# EAGLE design Rocketometer2148 (EAGLE 6.2)
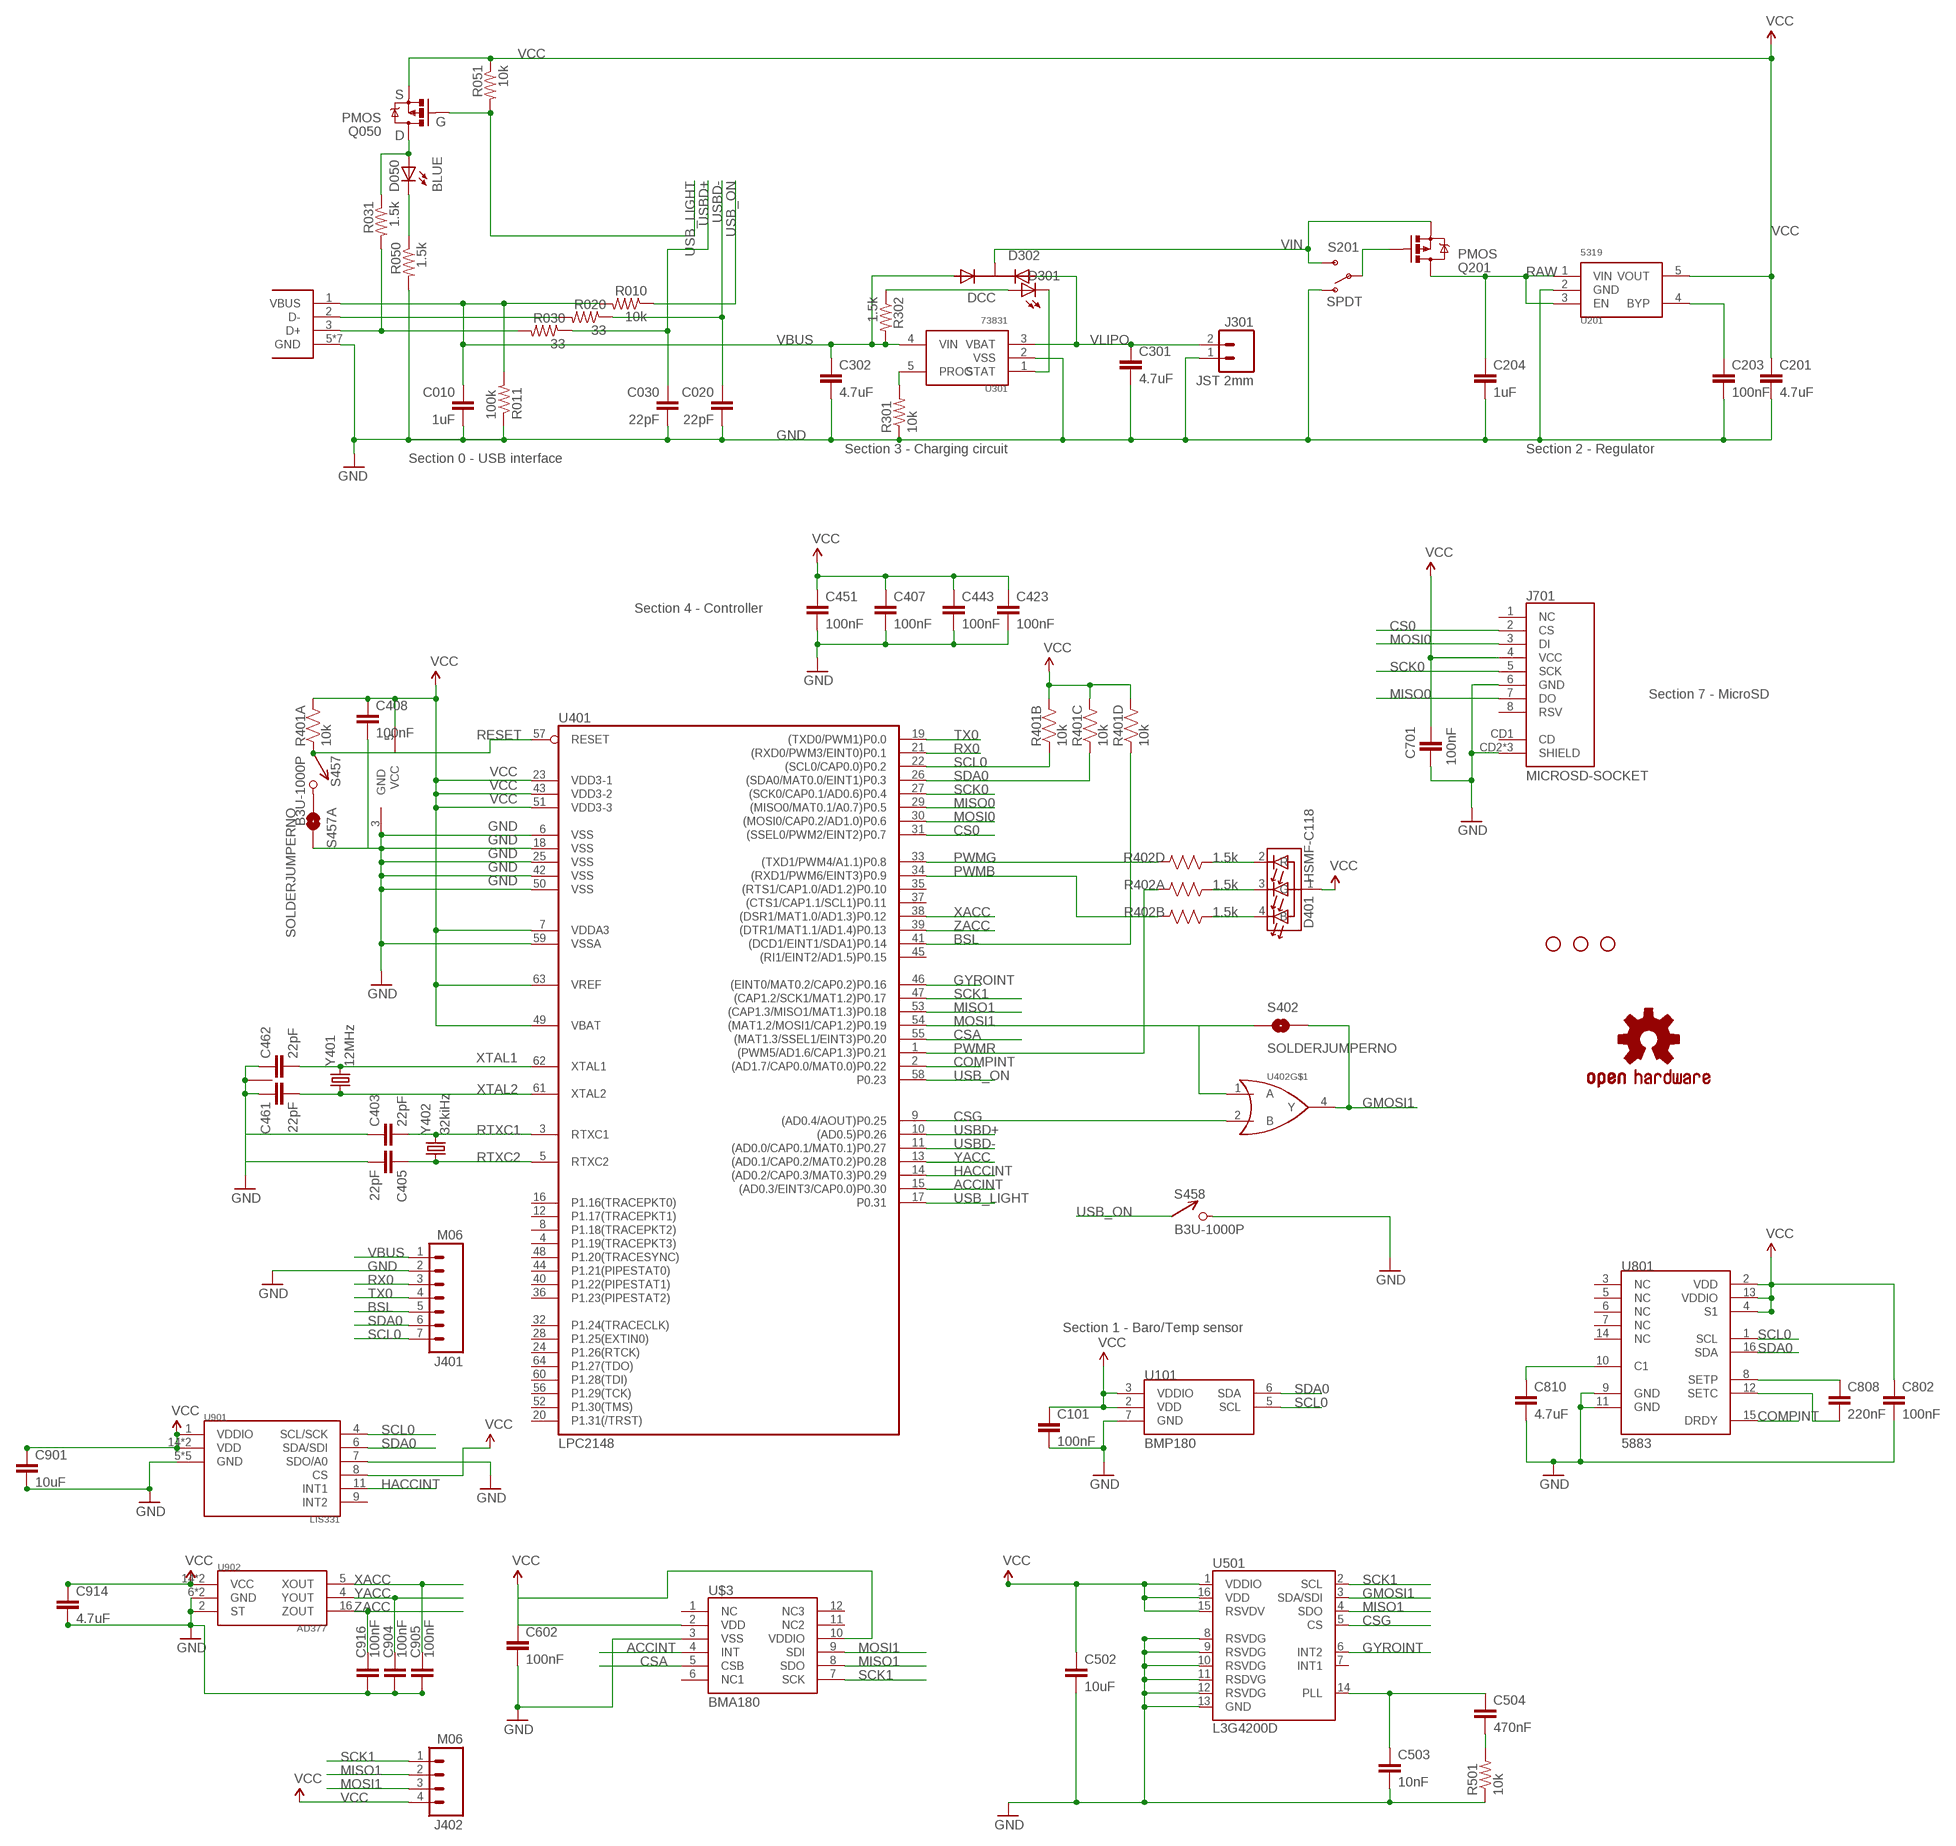
[diagram p0: schematic, sheet 1]

## Parts
C010  1uF  CAP0402-CAP  [0402-CAP]
C020  22pF  CAP0402-CAP  [0402-CAP]
C030  22pF  CAP0402-CAP  [0402-CAP]
C101  100nF  CAP0402-CAP  [0402-CAP]
C201  4.7uF  CAP0402-CAP  [0402-CAP]
C203  100nF  CAP0402-CAP  [0402-CAP]
C204  1uF  CAP0402-CAP  [0402-CAP]
C301  4.7uF  CAP0402-CAP  [0402-CAP]
C302  4.7uF  CAP0402-CAP  [0402-CAP]
C403  22pF  CAP0402-CAP  [0402-CAP]
C405  22pF  CAP0402-CAP  [0402-CAP]
C407  100nF  CAP0402-CAP  [0402-CAP]
C408  100nF  CAP0402-CAP  [0402-CAP]
C423  100nF  CAP0402-CAP  [0402-CAP]
C443  100nF  CAP0402-CAP  [0402-CAP]
C451  100nF  CAP0402-CAP  [0402-CAP]
C461  22pF  CAP0402-CAP  [0402-CAP]
C462  22pF  CAP0402-CAP  [0402-CAP]
C502  10uF  CAP0603-CAP  [0603-CAP]
C503  10nF  CAP0402-CAP  [0402-CAP]
C504  470nF  CAP0402-CAP  [0402-CAP]
C602  100nF  CAP0402-CAP  [0402-CAP]
C701  100nF  CAP0402-CAP  [0402-CAP]
C802  100nF  CAP0402-CAP  [0402-CAP]
C808  220nF  CAP0402-CAP  [0402-CAP]
C810  4.7uF  CAP0402-CAP  [0402-CAP]
C901  10uF  CAP0603-CAP  [0603-CAP]
C904  100nF  CAP0402-CAP  [0402-CAP]
C905  100nF  CAP0402-CAP  [0402-CAP]
C914  4.7uF  CAP0402-CAP  [0402-CAP]
C916  100nF  CAP0402-CAP  [0402-CAP]
D050  BLUE  LED0603  [LED-0603]
D301  YELLOW  LED0603  [LED-0603]
D302  DCC  PMEG2005CT  [SOT-23-3]
D401  HSMF-C118  [HSMF-C118]
J001  USB_MICROB_JST  [UB-MC5BR3-SD204-4S]
J301  JST 2mm  M02-JST-2MM-SMT  [JST-2-SMD]
J401  M06  M07  [1X07]
J402  M06  M04PTH  [1X04]
J701  MICROSD-SOCKET  [MICROSD-SOCKET-PP]
JP1  STAND-OFFTIGHT  [STAND-OFF-TIGHT]
JP2  STAND-OFFTIGHT  [STAND-OFF-TIGHT]
JP3  STAND-OFFTIGHT  [STAND-OFF-TIGHT]
Q050  PMOS  MOSFET-PCHANNELSMD  [SOT23-3]
Q201  PMOS  MOSFET-PCHANNELSMD  [SOT23-3]
R010  10k  RESISTOR0402-RES  [0402-RES]
R011  100k  RESISTOR0402-RES  [0402-RES]
R020  33  RESISTOR0402-RES  [0402-RES]
R030  33  RESISTOR0402-RES  [0402-RES]
R031  1.5k  RESISTOR0402-RES  [0402-RES]
R050  1.5k  RESISTOR0402-RES  [0402-RES]
R051  10k  RESISTOR0402-RES  [0402-RES]
R301  10k  RESISTOR0402-RES  [0402-RES]
R302  1.5k  RESISTOR0402-RES  [0402-RES]
R401  10k  RP404  [CRA04]
R402  1.5k  RP404  [CRA04]
R501  10k  RESISTOR0402-RES  [0402-RES]
S201  SPDT  SWITCH-SPSTSMD  [AYZ0202]
S402  SOLDERJUMPERNO  [SJ_2S-NO]
S457  B3U-1000P  [B3U-1000P]
S457A  SOLDERJUMPERNO  [SJ_2S-NO]
S458  B3U-1000P  [B3U-1000P]
U101  BMP180  [BMP180]
U201  5319  MIC5319D5  [SOT-23-5]
U301  73831  MCP73831  [SOT-23-5]
U401  LPC2148  LPC213X  [SQFP-S-10X10-64]
U402  SN74LVC1G32  [SOT-23-5]
U501  L3G4200D  [LGA16-4X4]
U801  5883  HMC5883LSMD  [16LPCC]
U901  LIS331  H3LIS331DL  [LLGA16]
U902  AD377  ADXL377  [ADXL377]
U$2  OSHW-LOGOS  [OSHW-LOGO-S]
U$3  BMA180  [LGA12]
Y401  12MHz  CX2520  [CRYSTAL_SMD_2MM_2_5MM]
Y402  32kiHz  ABS06  [ABS06]

## Nets
ACCINT: U401.15((AD0.3/EINT3/CAP0.0)P0.30) U$3.4(INT)
BSL: J401.5 R401.4 U401.41((DCD1/EINT1/SDA1)P0.14)
COMPINT: U401.2((AD1.7/CAP0.0/MAT0.0)P0.22) U801.15(DRDY)
CONN_D+: J001.3(D+) R030.2 R031.2
CONN_D-: J001.2(D-) R020.2
CS0: J701.2(CS) U401.31((SSEL0/PWM2/EINT2)P0.7)
CSA: U401.55((MAT1.3/SSEL1/EINT3)P0.20) U$3.5(CSB)
CSG: U401.9((AD0.4/AOUT)P0.25) U402.2(B) U501.5(CS)
GMOSI1: S402.2 U402.4(Y) U501.3(SDA/SDI)
GND [power]: C010.2 C020.2 C030.2 C101.2 C201.2 C203.2 C204.2 C301.2 C302.2 C403.1 C405.2 C407.2 C408.2 C423.2 C443.2 C451.2 C461.1 C462.1 C502.2 C503.2 C602.2 C701.2 C802.2 C810.2 C901.2 C904.2 C905.2 C914.2 C916.2 J001.5(GND) J001.P$6(GND) J001.P$7(GND) J001.P$8(GND) J001.P$9(GND) J001.P$10(GND) J001.P$11(GND) J301.1 J401.2 J701.6(GND) J701.CD2(SHIELD) J701.GND1(SHIELD) J701.GND3(SHIELD) R011.1 R050.2 R301.1 R501.1 S201.1(O) S457A.2 S458.P$2 U101.7(GND) U201.2(GND) U301.2(VSS) U401.6(VSS) U401.18(VSS) U401.25(VSS) U401.42(VSS) U401.50(VSS) U401.59(VSSA) U402.3(GND) U501.8(RSVDG) U501.9(RSVDG) U501.10(RSVDG) U501.11(RSDVG) U501.12(RSVDG) U501.13(GND) U801.9(GND) U801.11(GND) U901.5(GND) U901.7(SDO/A0) U901.10(GND) U901.12(GND) U901.13(GND) U901.16(GND) U902.2(ST) U902.6(GND) U902.7(GND) U$3.3(VSS) Y401.2 Y401.4
GYROINT: U401.46((EINT0/MAT0.2/CAP0.2)P0.16) U501.6(INT2)
HACCINT: U401.14((AD0.2/CAP0.3/MAT0.3)P0.29) U901.11(INT1)
MISO0: J701.7(DO) U401.29((MISO0/MAT0.1/A0.7)P0.5)
MISO1: J402.2 U401.53((CAP1.3/MISO1/MAT1.3)P0.18) U501.4(SDO) U$3.8(SDO)
MOSI0: J701.3(DI) U401.30((MOSI0/CAP0.2/AD1.0)P0.6)
MOSI1: J402.3 S402.1 U401.54((MAT1.2/MOSI1/CAP1.2)P0.19) U402.1(A) U$3.9(SDI)
N$1: C504.2 R501.2
N$2: R301.2 U301.5(PROG)
N$3: D401.4(B) R402.2
N$4: D301.C U301.1(STAT)
N$5: D301.A R302.1
N$6: D050.A Q050.3(D) R031.1
N$7: D050.C R050.1
N$8: S457.P$2 S457A.1
N$9: D401.2(R) R402.4
N$10: Q201.1(G) S201.2(P)
N$11: D401.3(G) R402.1
N$14: C808.1 U801.8(SETP)
N$15: C808.2 U801.12(SETC)
N$16: C810.1 U801.10(C1)
N$17: C203.1 U201.4(BYP)
N$20: C503.1 C504.1 U501.14(PLL)
PWMB: R402.7 U401.34((RXD1/PWM6/EINT3)P0.9)
PWMG: R402.5 U401.33((TXD1/PWM4/A1.1)P0.8)
PWMR: R402.8 U401.1((PWM5/AD1.6/CAP1.3)P0.21)
RAW: C204.1 Q201.3(D) U201.1(VIN) U201.3(EN)
RESET [power]: R401.1 S457.P$1 U401.57(RESET)
RTXC1: C403.2 U401.3(RTXC1) Y402.2
RTXC2: C405.1 U401.5(RTXC2) Y402.1
RX0: J401.3 U401.21((RXD0/PWM3/EINT0)P0.1)
SCK0: J701.5(SCK) U401.27((SCK0/CAP0.1/AD0.6)P0.4)
SCK1: J402.1 U401.47((CAP1.2/SCK1/MAT1.2)P0.17) U501.2(SCL) U$3.7(SCK)
SCL0: J401.7 R401.2 U101.5(SCL) U401.22((SCL0/CAP0.0)P0.2) U801.1(SCL) U901.4(SCL/SCK)
SDA0: J401.6 R401.3 U101.6(SDA) U401.26((SDA0/MAT0.0/EINT1)P0.3) U801.16(SDA) U901.6(SDA/SDI)
TX0: J401.4 U401.19((TXD0/PWM1)P0.0)
USB_LIGHT: Q050.1(G) R051.2 U401.17(P0.31)
USB_ON: R010.1 S458.P$1 U401.58(P0.23)
USBD+: C030.1 R030.1 U401.10((AD0.5)P0.26)
USBD-: C020.1 R020.1 U401.11((AD0.0/CAP0.1/MAT0.1)P0.27)
VBUS: C010.1 C302.1 D302.1(A1) J001.1(VBUS) J401.1 R010.2 R011.2 R302.2 U301.4(VIN)
VCC [power]: C101.1 C201.1 C407.1 C408.1 C423.1 C443.1 C451.1 C502.1 C602.1 C701.1 C802.1 C901.1 C914.1 D401.1(A) J402.4 J701.4(VCC) Q050.2(S) R051.1 R401.5 R401.6 R401.7 R401.8 U101.2(VDD) U101.3(VDDIO) U201.5(VOUT) U401.7(VDDA3) U401.23(VDD3-1) U401.43(VDD3-2) U401.49(VBAT) U401.51(VDD3-3) U401.63(VREF) U402.5(VCC) U501.1(VDDIO) U501.15(RSVDV) U501.16(VDD) U801.2(VDD) U801.4(S1) U801.13(VDDIO) U901.1(VDDIO) U901.8(CS) U901.14(VDD) U901.15(VDD) U902.14(VCC) U902.15(VCC) U$3.2(VDD) U$3.10(VDDIO)
VIN: D302.3(K) Q201.2(S) S201.3(S)
VLIPO: C301.1 D302.2(A2) J301.2 U301.3(VBAT)
XACC: C905.1 U401.38((DSR1/MAT1.0/AD1.3)P0.12) U902.5(XOUT)
XTAL1: C462.2 U401.62(XTAL1) Y401.3
XTAL2: C461.2 U401.61(XTAL2) Y401.1
YACC: C904.1 U401.13((AD0.1/CAP0.2/MAT0.2)P0.28) U902.4(YOUT)
ZACC: C916.1 U401.39((DTR1/MAT1.1/AD1.4)P0.13) U902.16(ZOUT)
Unconnected: J701.1(NC) J701.8(RSV) J701.CD1(CD) R402.3 R402.6 U401.4(P1.19(TRACEPKT3)) U401.8(P1.18(TRACEPKT2)) U401.12(P1.17(TRACEPKT1)) U401.16(P1.16(TRACEPKT0)) U401.20(P1.31(/TRST)) U401.24(P1.26(RTCK)) U401.28(P1.25(EXTIN0)) U401.32(P1.24(TRACECLK)) U401.35((RTS1/CAP1.0/AD1.2)P0.10) U401.36(P1.23(PIPESTAT2)) U401.37((CTS1/CAP1.1/SCL1)P0.11) U401.40(P1.22(PIPESTAT1)) U401.44(P1.21(PIPESTAT0)) U401.45((RI1/EINT2/AD1.5)P0.15) U401.48(P1.20(TRACESYNC)) U401.52(P1.30(TMS)) U401.56(P1.29(TCK)) U401.60(P1.28(TDI)) U401.64(P1.27(TDO)) U501.7(INT1) U801.3(NC) U801.5(NC) U801.6(NC) U801.7(NC) U801.14(NC) U901.9(INT2) U$3.1(NC) U$3.6(NC1) U$3.11(NC2) U$3.12(NC3)

## Notes on the sheet
- S
- G
- D
- Section 0 - USB interface | Section 3 - Charging circuit | Section 2 - Regulator
- Section 4 - Controller
- Section 7 - MicroSD
- Section 1 - Baro/Temp sensor

## Library data of the parts
C010 C204 = SparkFun:CAP: Capacitor Standard 0603 ceramic capacitor, and 0.1" leaded capacitor.; DIGIKEY: 445-1415-1-ND
C020 C030 C403 C405 C461 C462 = SparkFun:CAP: Capacitor Standard 0603 ceramic capacitor, and 0.1" leaded capacitor.; DIGIKEY: 445-1239-1-ND
C101 C203 C407 C408 C423 C443 C451 C701 C802 C904 C905 C916 = SparkFun:CAP: Capacitor Standard 0603 ceramic capacitor, and 0.1" leaded capacitor.; DIGIKEY: 445-1268-1-ND
C201 C301 C302 C602 C810 C914 = SparkFun:CAP: Capacitor Standard 0603 ceramic capacitor, and 0.1" leaded capacitor.; DIGIKEY: 445-7395-1-ND
C502 C901 = SparkFun:CAP: Capacitor Standard 0603 ceramic capacitor, and 0.1" leaded capacitor.; DIGIKEY: 445-7486-1-ND
C503 = SparkFun:CAP: Capacitor Standard 0603 ceramic capacitor, and 0.1" leaded capacitor.; DIGIKEY: 445-4943-1-ND
C504 = SparkFun:CAP: Capacitor Standard 0603 ceramic capacitor, and 0.1" leaded capacitor.; DIGIKEY: 445-4976-1-ND
C808 = SparkFun:CAP: Capacitor Standard 0603 ceramic capacitor, and 0.1" leaded capacitor.; DIGIKEY: 445-4972-1-ND
D050 = SparkFun:LED: LEDs Standard schematic elements and footprints for 5mm, 3mm, 1206, and 0603 sized LEDs. 5mm - Spark Fun Electronics SKU : COM-00529 (and others); DIGIKEY: 754-1434-1-ND
D301 = SparkFun:LED: LEDs Standard schematic elements and footprints for 5mm, 3mm, 1206, and 0603 sized LEDs. 5mm - Spark Fun Electronics SKU : COM-00529 (and others); DIGIKEY: 754-1354-1-ND
D302 = KwanSystems:PMEG2005CT; DIGIKEY: 568-6500-1-ND
D401 = KwanSystems:HSMF-C118; DIGIKEY: 516-1778-1-ND
J001 = KwanSystems:USB_MICROB_JST; DIGIKEY: 455-2562-1-ND
J301 = SparkFun:M02: Header 2 Standard 2-pin 0.1" header. Use with straight break away headers (SKU : PRT-00116), right angle break away headers (PRT-00553), swiss pins (PRT-00743), machine pins (PRT-00117), and female headers (PRT-00115). Molex polarized connector foot print use with SKU : PRT-08233 with associated crimp pins and housings.; DIGIKEY: 455-1749-1-ND
J401 = SparkFun-Connectors:M07: Header 7 Standard 7-pin 0.1" header. Use with straight break away headers (SKU : PRT-00116), right angle break away headers (PRT-00553), swiss pins (PRT-00743), machine pins (PRT-00117), and female headers (PRT-00115). NOTES ON THE VARIANTS LOCK and LOCK_LONGPADS... This footprint was designed to help hold the alignment of a through-hole component (i.e. 7-pin header) while soldering it into place. You may notice that each hole has been shifted either up or down by 0.005 of an inch from it's more standard position (which is usually a perfectly straight line). This slight alteration caused the pins (the squares in the middle) to touch the edges of the holes. Because they are alternating, it causes a "brace" to hold the header in place. 0.005 has proven to be the perfect amount of "off-center" position when using our standard breakaway headers. Although looks a little odd when you look at the bare footprint, once you have a header in there, the alteration is very hard to notice. Also, if you push a header all the way into place, it is covered up entirely on the bottom side. This idea of altering the position of holes to aid alignment will be further integrated into the Sparkfun Library for other footprints. It can help hold any component with 3 or more connection pins.; DIGIKEY: $NOPART
J402 = SparkFun-Connectors:M04: Header 4 Standard 4-pin 0.1" header. Use with straight break away headers (SKU : PRT-00116), right angle break away headers (PRT-00553), swiss pins (PRT-00743), machine pins (PRT-00117), and female headers (PRT-00115). Molex polarized connector foot print use with SKU : PRT-08231 with associated crimp pins and housings. 1MM SMD Version SKU: PRT-10208; DIGIKEY: $NOPART
J701 = KwanSystems:MICROSD-SOCKET: microSD Socket Push-push type uSD socket. Digikey 101-00660-68-6-1-ND. tDoc lines correctly indicate media card edge positions when inserting (unlocked, locked, depressed).; DIGIKEY: 101-00581-59-1-ND
JP1-JP3 = SparkFun-Electromechanical:STAND-OFF: #4 Stand Off This is the mechanical footprint for a #4 phillips button head screw. Use the keepout ring to avoid running the screw head into surrounding components. SKU : PRT-00447; DIGIKEY: $NOPART
Q050 Q201 = SparkFun:MOSFET-PCHANNEL; DIGIKEY: NTR1P02T1GOSCT-ND
R010 R051 R301 R501 = SparkFun:RESISTOR: Resistor Basic schematic elements and footprints for 0603, 1206, and PTH resistors.; DIGIKEY: P10.0KLCT-ND
R011 = SparkFun:RESISTOR: Resistor Basic schematic elements and footprints for 0603, 1206, and PTH resistors.; DIGIKEY: P100KLCT-ND
R020 R030 = SparkFun:RESISTOR: Resistor Basic schematic elements and footprints for 0603, 1206, and PTH resistors.; DIGIKEY: P33.0LCT-ND
R031 R050 R302 = SparkFun:RESISTOR: Resistor Basic schematic elements and footprints for 0603, 1206, and PTH resistors.; DIGIKEY: P1.50KLCT-ND
R401 = KwanSystems:RP4; DIGIKEY: CRA4S810KCT-ND
R402 = KwanSystems:RP4; DIGIKEY: CRA4S81.5KCT-ND
S201 = SparkFun:SWITCH-SPST: SPST Switch Simple slide switch. Spark Fun Electronics SKU : COM-00102; DIGIKEY: 401-2013-1-ND
S402 S457A = SparkFun-Passives:SOLDERJUMPER: Solder Jumper Standard SMD solder jumper. Used to automate production. Two varients : Normally Open and Normally Closed are the same, but have different paste layers. NC will have a large amount of paste and should jumper during reflow.; DIGIKEY: $NOPART
S457 S458 = KwanSystems:B3U-1000P; DIGIKEY: SW1020CT-ND
U101 = KwanSystems:BMP180; DIGIKEY: 828-1027-1-ND
U201 = KwanSystems:MIC5319; DIGIKEY: 576-1910-1-ND
U301 = KwanSystems:MCP73831; DIGIKEY: MCP73831T-2ACI/OTCT-ND
U401 = SparkFun:LPC213X: LPC213x Schematic element and footprint for NXP LPC213x. Spark Fun Electronics SKU : COM-00520; DIGIKEY: 568-1765-ND
U402 = KwanSystems:SN74LVC1G32
U501 = SparkFun:L3G4200D: L3G4200D Three-axis, digital output gyroscope The L3G4200D is a low-power three-axis angular rate sensor, has a full scale of ±250/±500/±2000 dps and is capable of measuring rates with a user-selectable bandwidth. It includes a sensing element and an IC interface capable of providing the measured angular rate to the external world through a digital interface (I2C/SPI). Package: 4x4x1.1 LGA-16 (LGA16-4x4.PAC); DIGIKEY: 497-11071-1-ND
U801 = SparkFun:HMC5883L: 3 Axis Digital Compass IC; DIGIKEY: 342-1082-1-ND
U901 = KwanSystems:H3LIS331DL
U902 = KwanSystems:ADXL377
U$2 = SparkFun-Aesthetics:OSHW-LOGO: Open Source Hardware Logo This logo indicates the piece of hardware it is found on incorporates a OSHW license and/or adheres to the definition of open source hardware found here: http://freedomdefined.org/OSHW; DIGIKEY: $NOPART
U$3 = SparkFun-Sensors:BMA180: 3-axis, 14-bit SPI/I2C accelerometer. Range 1/1.5/2/3/4/8/16g.
Y401 = KwanSystems:CX2520
Y402 = KwanSystems:ABS06; DIGIKEY: 535-10248-1-ND

## Net classes
0 default: width 0.152 mm, drill 0.33 mm, clearance 0.152 mm
1 power: width 0.152 mm, drill 0.33 mm, clearance 0.152 mm to class 0, clearance 0.152 mm
2 hv: width 0.152 mm, drill 0.33 mm, clearance 0.152 mm to class 0, clearance 0.152 mm to class 1, clearance 0.152 mm

## Board
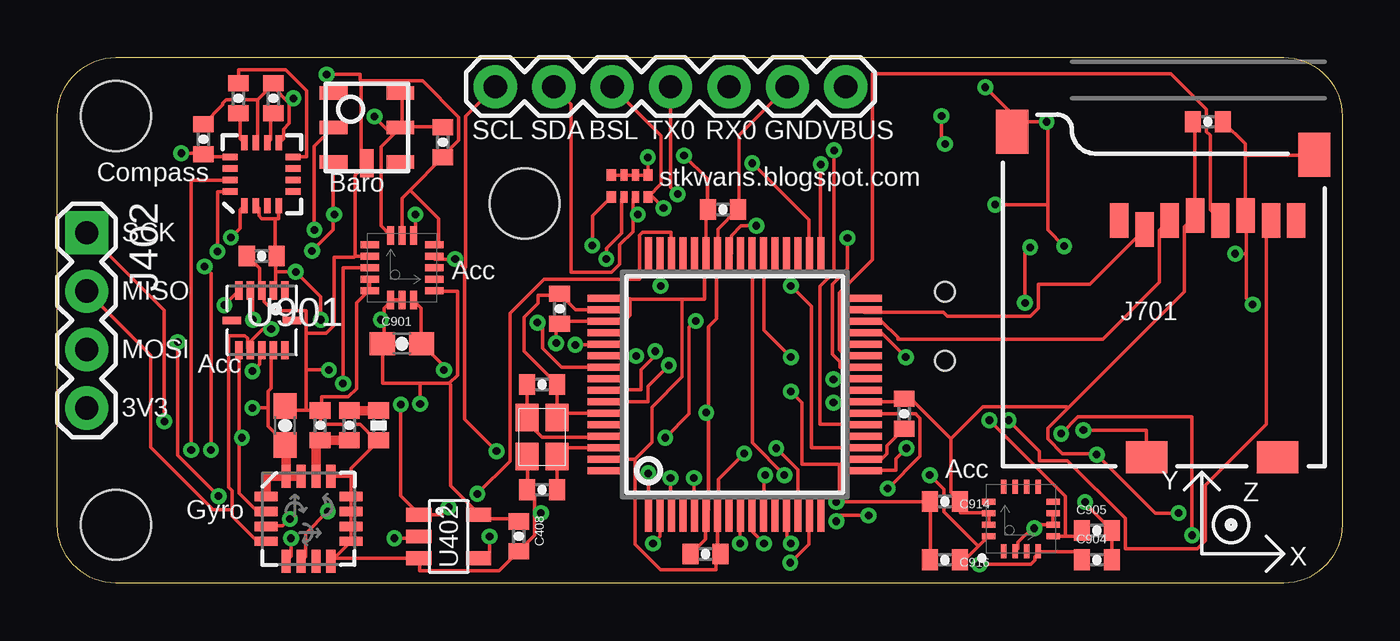
[diagram p1: board, top side]
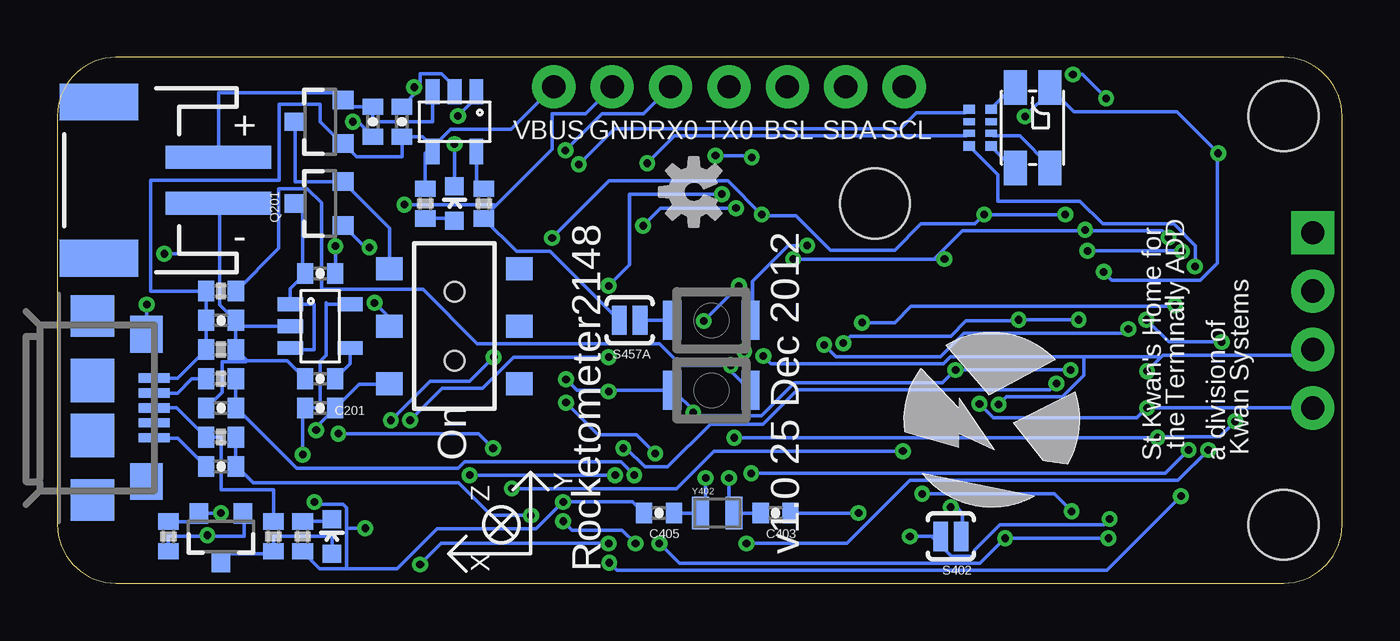
[diagram p2: board, bottom side, seen from below]

Size 55.88 x 22.86 mm. Coordinates in mm from the lower left corner, seen from the top.
Outline: 2.54,22.86 53.34,22.86 arc-90 55.88,20.32 55.88,2.54 arc-90 53.34,0 2.54,0 arc-90 0,2.54 0,20.32 arc-90 2.54,22.86
Copper layers (1*16): Top 0.0356mm / dielectric 1.5011mm / Bottom 0.0356mm
Design rules "default": minimum track width 6mil, minimum drill 13mil, track to track 6mil, track to pad 6mil, pad to pad 6mil, via to via 6mil, smd to smd 6mil, copper to edge 15mil, drill to drill 6mil, minimum pad ring 7mil, minimum via ring 7mil, stop-mask expansion 4mil, vias tented up to drill 14mil, thermal gap 10mil
tRestrict: area 7.9,16.8 to 9.9,18.8; area 9.9,18.8 to 10.7,19.6; area 9.9,16 to 10.7,16.8; area 7.1,18.8 to 7.9,19.6; area 7.1,16 to 7.9,16.8
bRestrict: area 7.1,16 to 10.7,19.6
vRestrict: area 32.3,13.2 to 33.5,17.8; area 32.3,1.5 to 33.3,13.2; area 32.3,0.5 to 33.5,1.5; area 23.6,14.7 to 24.9,19; area 23.6,10.2 to 24.9,13.2; area 23.6,6.6 to 24.9,8.6; area 23.6,2.5 to 24.9,5.1; area 23.6,1.3 to 24.6,2.5; area 38.1,5.3 to 39.4,7.4; area 12.4,8.3 to 17.1,10.9; area 15.1,5.8 to 18.9,9.3; area 11.7,5.2 to 14.2,8.3; 14 more areas

### Footprints (pad centres in the part's own frame; a part is rotated, then mirrored left to right if it is on the bottom)
0402-CAP = smd 0.7 x 0.9: 1 -0.65,0; 2 0.65,0
0603-CAP = smd 1.1 x 1: 1 -0.85,0; 2 0.85,0
LED-0603 = smd 0.8 x 0.8: A 0,-0.75; C 0,0.75
SOT-23-3 = smd 0.9 x 0.8: 1 -1,0.95; 2 -1,-0.95; 3 1.1,0
HSMF-C118 = smd 1.5 x 1: 1 1.75,-0.75; 2 1.75,0.75; 3 -1.75,0.75; 4 -1.75,-0.75
UB-MC5BR3-SD204-4S = smd 0.4 x 1.35: 1 -1.3,2.675; 2 -0.65,2.675; 3 0,2.675; 4 0.65,2.675; 5 1.3,2.675 | smd 1.8 x 1.9: P$6 4,0; P$7 -4,0 | smd 1.9 x 1.9: P$8 -1.2,0; P$9 1.2,0 | smd 1.6 x 1.4: P$10 -3.2,2.35; P$11 3.2,2.35
JST-2-SMD = smd 1 x 4.6: 1 -1,-3.7; 2 1,-3.7 | smd 1.6 x 3.4: NC1 -3.4,1.5; NC2 3.4,1.5
1X07 = drill 1.016 pad 1.88: 1 0,0; 2 2.54,0; 3 5.08,0; 4 7.62,0; 5 10.16,0; 6 12.7,0; 7 15.24,0
1X04 = drill 1.016 pad 1.88 square: 1 0,0 | drill 1.016 pad 1.88: 2 2.54,0; 3 5.08,0; 4 7.62,0
MICROSD-SOCKET-PP = smd 0.8 x 1.5: 1 -8.94,10.7; 2 -7.84,10.3; 3 -6.74,10.7; 4 -5.64,10.9; 5 -4.54,10.7; 6 -3.44,10.9; 7 -2.34,10.7; 8 -1.24,10.7 | smd 1.8 x 1.4: CD1 -2.05,0.4; CD2 -7.75,0.4 | smd 1.4 x 1.9: GND1 -13.6,14.55; GND3 -0.45,13.55
STAND-OFF-TIGHT = hole 3.048: 0,0
SOT23-3 = smd 0.8 x 0.9: 1 -0.95,-1; 2 0.95,-1; 3 0,1.1
0402-RES = smd 0.7 x 0.9: 1 -0.65,0; 2 0.65,0
CRA04 = smd 0.4 x 0.5: 1 -0.8,-0.475; 4 0.8,-0.475; 5 0.8,0.475; 8 -0.8,0.475 | smd 0.3 x 0.5: 2 -0.25,-0.475; 3 0.25,-0.475; 6 0.25,0.475; 7 -0.25,0.475
AYZ0202 = smd 1 x 1.15: 1 -2.5,2.825; 2 0,2.825; 3 2.5,2.825; 4 -2.5,-2.825; 5 0,-2.825; 6 2.5,-2.825 | hole 0.85: 1.5,0; -1.5,0
SJ_2S-NO = smd 0.635 x 1.27: 1 -0.45,0; 2 0.45,0
B3U-1000P = smd 0.8 x 1.7: P$1 -1.7,0; P$2 1.7,0
BMP180 = smd 0.6 x 1.2: 1 1.5,1.45; 2 0,1.45; 3 -1.5,1.45; 4 -1.5,-1.45; 5 0,-1.45; 6 1.5,-1.45 | smd 1.2 x 0.6: 7 1.55,0
SOT-23-5 = smd 0.6 x 1.1: 1 -0.95,-1.3; 2 0,-1.3; 3 0.95,-1.3; 4 0.95,1.3; 5 -0.95,1.3
SQFP-S-10X10-64 = smd 0.3 x 1.6: 1 -3.75,-5.6; 2 -3.25,-5.6; 3 -2.75,-5.6; 4 -2.25,-5.6; 5 -1.75,-5.6; 6 -1.25,-5.6; 7 -0.75,-5.6; 8 -0.25,-5.6; 9 0.25,-5.6; 10 0.75,-5.6; 11 1.25,-5.6; 12 1.75,-5.6; 13 2.25,-5.6; 14 2.75,-5.6; 15 3.25,-5.6; 16 3.75,-5.6; 33 3.75,5.6; 34 3.25,5.6; 35 2.75,5.6; 36 2.25,5.6; 37 1.75,5.6; 38 1.25,5.6; 39 0.75,5.6; 40 0.25,5.6; 41 -0.25,5.6; 42 -0.75,5.6; 43 -1.25,5.6; 44 -1.75,5.6; 45 -2.25,5.6; 46 -2.75,5.6; 47 -3.25,5.6; 48 -3.75,5.6 | smd 1.6 x 0.3: 17 5.6,-3.75; 18 5.6,-3.25; 19 5.6,-2.75; 20 5.6,-2.25; 21 5.6,-1.75; 22 5.6,-1.25; 23 5.6,-0.75; 24 5.6,-0.25; 25 5.6,0.25; 26 5.6,0.75; 27 5.6,1.25; 28 5.6,1.75; 29 5.6,2.25; 30 5.6,2.75; 31 5.6,3.25; 32 5.6,3.75; 49 -5.6,3.75; 50 -5.6,3.25; 51 -5.6,2.75; 52 -5.6,2.25; 53 -5.6,1.75; 54 -5.6,1.25; 55 -5.6,0.75; 56 -5.6,0.25; 57 -5.6,-0.25; 58 -5.6,-0.75; 59 -5.6,-1.25; 60 -5.6,-1.75; 61 -5.6,-2.25; 62 -5.6,-2.75; 63 -5.6,-3.25; 64 -5.6,-3.75
LGA16-4X4 = smd 1 x 0.4: 1 -1.85,0.975; 2 -1.85,0.325; 3 -1.85,-0.325; 4 -1.85,-0.975; 9 1.85,-0.975; 10 1.85,-0.325; 11 1.85,0.325; 12 1.85,0.975 | smd 0.4 x 1: 5 -0.975,-1.85; 6 -0.325,-1.85; 7 0.325,-1.85; 8 0.975,-1.85; 13 0.975,1.85; 14 0.325,1.85; 15 -0.325,1.85; 16 -0.975,1.85
16LPCC = smd 0.65 x 0.28: 1 -1.37,0.75; 2 -1.37,0.25; 3 -1.37,-0.25; 4 -1.37,-0.75; 9 1.37,-0.75; 10 1.37,-0.25; 11 1.37,0.25; 12 1.37,0.75 | smd 0.28 x 0.65: 5 -0.75,-1.37; 6 -0.25,-1.37; 7 0.25,-1.37; 8 0.75,-1.37; 13 0.75,1.37; 14 0.25,1.37; 15 -0.25,1.37; 16 -0.75,1.37
LLGA16 = smd 0.8 x 0.3: 1 -1.4,1; 2 -1.4,0.5; 3 -1.4,0; 4 -1.4,-0.5; 5 -1.4,-1; 9 1.4,-1; 10 1.4,-0.5; 11 1.4,0; 12 1.4,0.5; 13 1.4,1 | smd 0.3 x 0.8: 6 -0.5,-1.4; 7 0,-1.4; 8 0.5,-1.4; 14 0.5,1.4; 15 0,1.4; 16 -0.5,1.4
ADXL377 = smd 0.6 x 0.25: 1 -1.4,0.75; 2 -1.4,0.25; 3 -1.4,-0.25; 4 -1.4,-0.75; 9 1.4,-0.75; 10 1.4,-0.25; 11 1.4,0.25; 12 1.4,0.75 | smd 0.25 x 0.6: 5 -0.75,-1.4; 6 -0.25,-1.4; 7 0.25,-1.4; 8 0.75,-1.4; 13 0.75,1.4; 14 0.25,1.4; 15 -0.25,1.4; 16 -0.75,1.4
LGA12 = smd 0.8 x 0.32: 1 -1.3,1; 2 -1.3,0.5; 3 -1.3,0; 4 -1.3,-0.5; 5 -1.3,-1; 7 1.3,-1; 8 1.3,-0.5; 9 1.3,0; 10 1.3,0.5; 11 1.3,1 | smd 0.32 x 0.8: 6 0,-1.3; 12 0,1.3
CRYSTAL_SMD_2MM_2_5MM = smd 1.2 x 1: 1 -0.85,-0.65; 2 0.85,-0.65; 3 0.85,0.65; 4 -0.85,0.65
ABS06 = smd 0.75 x 1.4: 1 -0.725,0; 2 0.725,0

### Placement (x,y rotation side)
C010  48.77,11.43 0 bottom
C020  48.77,7.62 180 bottom
C030  48.77,5.08 180 bottom
C101  16.76,19.18 270 top
C201  44.45,7.62 0 bottom
C203  44.45,8.89 180 bottom
C204  44.45,13.46 0 bottom
C301  42.16,20.07 270 bottom
C302  40.89,20.07 90 bottom
C403  24.64,3.05 180 bottom
C405  29.72,3.05 180 bottom
C407  28.19,1.27 180 top
C408  20.07,2.03 270 top
C423  36.83,7.37 270 top
C443  28.96,16.26 0 top
C451  21.84,11.94 90 top
C461  21.08,8.64 180 top
C462  21.08,4.06 0 top
C502  9.91,6.86 90 top
C503  11.43,6.86 90 top
C504  12.7,6.86 90 top
C602  8.89,14.22 180 top
C701  50.04,20.07 0 top
C802  6.35,19.3 90 top
C808  7.87,21.08 270 top
C810  9.4,21.08 90 top
C901  14.99,10.41 0 top
C904  45.21,1.02 0 top
C905  45.21,2.29 0 top
C914  38.61,3.56 180 top
C916  38.61,1.02 180 top
D050  43.94,2.03 0 bottom
D301  38.61,16.51 0 bottom
D302  44.45,20.07 180 bottom
D401  13.46,19.81 90 bottom
J001  54.36,7.62 270 bottom
J301  52.58,17.53 90 bottom
J401  34.29,21.59 180 top
J402  1.27,15.24 270 top
J701  55.13,5.08 0 top
JP1  2.54,2.54 0 top
JP2  2.54,20.32 0 top
JP3  20.32,16.51 0 top
Q050  48.77,2.03 180 bottom
Q201  44.45,16.51 90 bottom
R010  48.77,12.7 180 bottom
R011  48.77,10.16 180 bottom
R020  48.77,8.89 180 bottom
R030  48.77,6.35 180 bottom
R031  46.48,2.03 90 bottom
R050  45.21,2.03 270 bottom
R051  51.05,2.03 270 bottom
R301  37.34,16.51 90 bottom
R302  39.88,16.51 90 bottom
R401  24.89,17.27 0 top
R402  15.75,19.81 90 bottom
R501  13.97,6.86 90 top
S201  38.61,11.18 90 bottom
S402  17.02,2.03 180 bottom
S457  27.43,11.43 180 bottom
S457A  30.99,11.43 180 bottom
S458  27.43,8.38 180 bottom
U101  13.46,19.81 270 top
U201  44.45,11.18 270 bottom
U301  38.61,20.07 180 bottom
U401  29.46,8.64 0 top
U402  17.02,2.03 270 top
U501  10.92,2.79 0 top
U801  8.89,17.78 90 top
U901  14.99,13.72 180 top
U902  41.91,2.79 90 top
U$1  [KWAN_CIRCLE]  15.24,7.11 90 bottom
U$2  28.19,17.02 90 bottom
U$3  8.89,11.43 270 top
Y401  21.08,6.35 270 top
Y402  27.18,3.05 0 bottom

### Tracks (layer width: path | path; a pad name or v marks a point on that pad's centre or on a via)
ACCINT  (via drill 0.33)
  Top 0.152: v8.51,11.46 8.48,11.48 8.48,12.65 8.41,12.72 U$3.4 | v5.23,10.49 5.23,5.56 v7.01,3.79 | v31.88,0.89 32.69,1.7 32.69,3.02 U401.15
  Bottom 0.152: v8.51,11.46 7.54,10.49 v5.23,10.49 | v7.01,3.79 10.24,0.56 31.55,0.56 v31.88,0.89
BSL  (via drill 0.33)
  Top 0.152: J401.5 26.26,19.46 26.26,17.37 25.7,16.82 R401.4 25.83,16.84 v26.36,16.31 | v30.4,15.54 29.74,15.54 29.31,15.11 29.31,14.33 29.23,14.25 U401.41
  Bottom 0.152: v30.4,15.54 29.64,16.31 v26.36,16.31
COMPINT  (via drill 0.33)
  Top 0.152: v5.82,5.79 5.82,17.53 U801.15 | v25.91,1.73 26.21,2.03 26.21,3.02 U401.2
  Bottom 0.152: v5.82,5.79 7.14,4.47 18.8,4.47 21.54,1.73 v25.91,1.73
CONN_D+
  Bottom 0.152: J001.3 50.69,7.62 R030.2 48.77,6.35 48.77,4.06 46.48,4.06 R031.2
CONN_D-
  Bottom 0.152: R020.2 50.04,8.89 50.66,8.27 J001.2
CS0
  Top 0.152: J701.2 47.27,15.37 44.91,13.01 42.67,13.01 42.67,11.96 42.32,11.61 38.71,11.61 38.53,11.79 35.08,11.79 35.08,11.86 U401.31
CSA  (via drill 0.33)
  Top 0.152: v7.26,12.09 7.26,12.12 7.87,12.72 U$3.5 | v20.88,11.33 21.11,11.1 21.11,10.21 21.92,9.4 U401.55
  Bottom 0.152: v7.26,12.09 7.32,12.04 18.75,12.04 19.46,11.33 v20.88,11.33
CSG  (via drill 0.33)
  Top 0.152: v10.16,1.96 10.16,1.17 9.96,0.96 U501.5 | v14.66,1.96 15.7,1.96 15.7,2.03 U402.2 | v29.69,1.73 29.69,3.02 U401.9
  Bottom 0.152: v10.16,1.96 v14.66,1.96 15.75,0.86 28.83,0.86 v29.69,1.73
GMOSI1  (via drill 0.33)
  Top 0.152: U402.4 18.8,1.08 v18.8,2.03 | v10.11,2.79 9.8,2.49 9.09,2.49 U501.3
  Bottom 0.152: v18.8,2.03 17.8,2.03 | 17.8,2.03 S402.2 | v10.11,2.79 10.36,2.54 14.88,2.54 16,1.42 16,1.17 16.99,1.17 17.8,1.98 17.8,2.03
GND  (via drill 0.33)
  Top 0.152: 20.75,3.05 20.75,3.76 20.45,4.06 C462.1 20.45,4.12 20.45,5.49 Y401.2 | 20.75,3.05 20.75,2.08 20.07,1.4 C408.2 20.02,1.35 19.2,0.53 15.75,0.53 15.75,1.02 U402.3 15.7,1.09 12.14,1.09 12.09,1.14 | 20.75,3.05 v21.03,3.05 | U401.50 22.53,11.89 21.84,12.57 C451.2 21.79,12.52 20.9,12.52 20.9,12.17 20.3,11.56 20.3,10.08 21.69,8.69 C461.1 21.74,8.64 21.74,7.21 Y401.4 21.79,7.39 U401.59 | 12.78,4.65 12.78,3.79 U501.12 12.78,3.71 12.78,3.17 U501.11 12.78,3.1 12.78,2.54 U501.10 12.78,1.88 U501.9 12.75,1.8 12.09,1.14 | 12.78,4.65 12.78,5 13.97,6.2 R501.1 13.87,6.2 13.16,6.91 11.46,6.91 11.46,7.44 C503.2 | 12.78,4.65 11.91,4.65 U501.13 | 12.09,1.14 11.91,0.96 U501.8 | 8.71,21.03 8.71,19.2 8.66,19.15 U801.11 | 8.71,21.03 9.4,21.72 C810.2 9.37,21.59 10.08,20.88 | 10.08,20.88 10.08,19.99 9.83,19.74 9.83,19.33 9.65,19.15 U801.9 | 8.71,21.03 7.34,21.03 7.19,20.88 7.19,20.8 6.35,19.96 C802.2 | U901.7 14.99,16.74 15.34,17.09 | 15.34,17.09 16.76,18.52 C101.2 16.79,18.59 17.45,19.25 17.45,20.27 15.88,21.84 13.21,21.84 | 15.34,17.09 16.59,15.85 16.59,14.73 16.41,14.73 U901.5 | 12.95,14.22 13.56,14.22 U901.10 | 12.95,14.22 12.95,17.73 13.46,18.24 U101.7 | U101.7 | C602.2 8.26,14.22 8.79,13.69 8.79,12.85 8.89,12.75 U$3.3 8.94,12.68 8.99,12.62 8.99,12.24 9.4,11.84 10.82,11.84 10.82,10.87 | U901.12 13.59,13.21 U901.13 13.51,12.7 13.01,12.19 13.01,8.46 12.65,8.1 11.48,8.1 11.48,7.57 C503.2 | 10.82,7.52 9.91,7.52 C502.2 | 10.82,7.52 C503.2 | 10.82,7.52 10.82,9.27 | 10.82,9.27 10.82,10.87 | 10.82,10.87 11.68,10.87 12.04,11.23 12.04,14.17 12.9,14.17 12.95,14.22 | 13.21,21.84 13.21,18.09 U101.7
  Top 0.152: 10.08,20.88 10.26,21.06 v10.26,21.08 | v11.71,22.12 13.16,22.12 13.16,21.89 13.21,21.84 | 51.66,18.62 51.66,16 J701.6 51.71,15.93 51.71,14.33 | 51.66,18.62 51.66,19.1 C701.2 | v43.79,14.66 43.08,15.37 43.08,16.46 | 43.08,16.46 43.08,20.02 v43.03,20.07 41.53,20.07 J701.GND1 41.48,20.12 41.48,20.45 v40.36,21.57 | v44.63,6.66 47.37,6.66 J701.CD2 | 51.66,18.62 54.66,18.62 J701.GND3 | v51.99,12.12 51.71,12.39 51.71,14.33 | 51.71,14.33 v51.23,14.33 | C407.2 27.56,1.27 28.19,1.91 28.19,3.02 U401.6 28.25,3.1 28.32,3.17 28.32,7.42 | 28.32,7.42 28.32,11.15 28.68,11.51 28.68,14.17 U401.42 28.73,14.25 28.73,15.39 29.59,16.26 C443.2 29.64,16.31 29.64,19.48 J401.2 | C916.2 37.97,1.02 37.97,3.56 C914.2 37.9,3.53 v33.88,3.53 34.01,3.66 34.01,5.13 | 42.44,2.44 42.55,2.54 U902.6 43.31,2.62 43.31,3.02 U902.7 | 42.44,2.44 41.78,1.78 41.78,1.5 41.68,1.4 U902.2 | C904.2 45.87,1.02 45.87,2.29 C905.2 45.82,2.34 44.7,3.45 v44.7,3.53 | 34.01,5.13 34.27,5.38 U401.18 35.13,5.41 35.87,5.41 36.09,5.64 36.09,5.97 36.83,6.71 C423.2 | v42.49,2.39 42.44,2.44 | U901.16 15.49,12.29 15.82,11.96 15.82,10.41 C901.2 15.88,10.36 16.82,9.42 v16.82,9.27 | v33.76,8.87 35.05,8.87 U401.25 | v31.9,8.33 32.38,7.85 32.38,5.18 33.96,5.18 34.01,5.13 | v28.22,7.42 28.32,7.42 | v40.79,16.46 43.08,16.46 | v11.81,9.27 10.82,9.27
  Bottom 0.152: v21.03,3.05 C403.1 | v10.26,21.08 11.3,22.12 v11.71,22.12 | 47.62,9.68 45.9,9.68 C203.2 | 47.62,9.68 48.11,10.16 R011.1 48.13,10.21 48.13,11.43 C010.2 | C020.2 49.4,7.62 48.72,8.31 48.72,9.63 47.68,9.63 47.62,9.68 | U201.2 48.08,11.18 C010.2 | 48.82,14.33 48.82,16.51 48.87,16.51 J301.1 | 48.82,14.33 48.82,12.12 48.18,11.48 C010.2 | C030.2 50.65,6.3 51.66,6.3 J001.5 | S201.1 41.45,8.66 42.75,8.66 C201.2 43.84,7.57 44.63,6.78 v44.63,6.66 | 40.21,21.41 40.11,21.51 40.11,22.15 39.17,22.15 38.61,21.59 U301.2 | 40.21,21.41 C302.2 | v43.03,20.07 42.8,20.07 42.16,19.43 C301.2 | v43.79,14.66 C204.2 | v40.36,21.57 40.21,21.41 | v51.99,12.12 51.99,10.82 J001.P$10 | v51.23,14.33 48.82,14.33 | S457A.2 34.44,14.43 35.92,14.43 R301.1 37.31,15.93 36.83,16.41 | 36.83,16.41 34.37,18.87 34.37,20.42 32.92,20.42 J401.2 | C405.2 30.86,3.53 v33.88,3.53 35.05,2.36 39.37,2.36 41.1,0.64 43.31,0.64 | 43.31,0.64 44.48,0.64 R050.2 | v44.7,3.53 44.6,3.43 43.46,3.43 43.31,3.28 43.31,2.39 | 43.31,0.64 43.31,2.39 | 43.31,2.39 v42.49,2.39 | v33.76,8.87 33.27,8.38 31.9,8.38 | 31.9,8.38 S458.P$2 29.06,8.36 28.17,7.47 | 28.17,7.47 27.99,7.29 25.25,7.29 23.82,8.71 17.37,8.71 v16.82,9.27 v11.81,9.27 | v31.9,8.33 31.9,8.38 | v28.22,7.42 28.17,7.47 | v40.79,16.46 36.88,16.46 36.83,16.41
GYROINT  (via drill 0.33)
  Top 0.152: v11.76,3.12 10.79,2.16 10.79,1.14 10.62,0.96 U501.6 | v18.26,3.89 19.68,5.31 19.68,11.73 21.16,13.21 25.32,13.21 25.32,15.14 25.45,15.27 26.7,15.27 26.7,14.25 U401.46
  Bottom 0.152: v11.76,3.12 12.52,3.89 v18.26,3.89
HACCINT  (via drill 0.33)
  Top 0.152: U901.11 12.42,13.72 v12.42,8.69 | v31.27,5.87 32.21,4.93 U401.14
  Bottom 0.152: v12.42,8.69 12.7,8.41 23.7,8.41 25.2,6.91 27.48,6.91 29.34,5.05 30.33,5.05 31.14,5.87 v31.27,5.87
MISO0  (via drill 0.33)
  Top 0.152: v41.38,7.09 42.72,5.74 42.72,5.33 43.94,5.33 46.46,2.82 46.46,1.5 49.58,1.5 49.94,1.85 49.94,4.27 52.58,6.91 52.58,15.57 J701.7 | v36.91,9.83 35.87,10.87 35.08,10.87 U401.29
  Bottom 0.152: v41.38,7.09 39.67,8.79 37.95,8.79 v36.91,9.83
MISO1  (via drill 0.33)
  Top 0.152: 7.59,3.2 7.59,2.92 8.69,1.83 U501.4 | 7.59,3.2 7.59,4.01 7.44,4.17 7.44,10.77 8.15,10.77 8.28,10.64 8.28,10.24 U$3.8 8.33,10.46 8.91,11.05 v9.3,11.05 | v22.53,10.36 23.85,10.36 U401.53 | J402.2 4.06,9.91 4.06,5.92 6.78,3.2 7.59,3.2
  Bottom 0.152: v22.53,10.36 22.02,9.86 17.48,9.86 16.46,10.87 9.47,10.87 v9.3,11.05
MOSI0
  Top 0.152: J701.3 48.36,15.77 47.93,15.34 47.93,13.08 45.47,10.62 36.55,10.62 36.55,10.69 35.87,11.38 35.08,11.38 U401.30
MOSI1  (via drill 0.33)
  Top 0.152: v17.02,3.3 16.7,2.98 U402.1 15.7,3.05 14.94,3.81 v14.94,7.77 | v8.48,9.22 8.79,9.53 8.79,10.01 8.89,10.11 U$3.9 | v25.17,9.88 23.88,9.88 U401.54
  Bottom 0.152: S402.1 16.51,2.03 16.51,3.05 16.76,3.3 v17.02,3.3 | 7.9,9.8 7.8,9.91 1.52,9.91 J402.3 | 7.9,9.8 v8.48,9.22 | v25.17,9.88 24.84,9.55 17.35,9.55 17.04,9.86 11.23,9.86 | 11.23,9.86 7.95,9.86 7.9,9.8 | v14.94,7.77 14.61,8.1 12.17,8.1 11.23,9.04 11.23,9.86
N$1
  Top 0.406: R501.2 C504.2
N$2
  Bottom 0.152: U301.5 37.66,17.48 R301.2
N$3
  Bottom 0.152: R402.2 15.16,19.46 14.02,19.46 12.72,18.16 12.72,18.09 D401.4
N$4  (via drill 0.33)
  Top 0.152: v38.61,19.1 38.46,19.25 v38.46,20.32
  Bottom 0.152: v38.61,19.1 D301.C | v38.46,20.32 37.67,21.11 U301.1
N$5
  Bottom 0.152: R302.1 38.71,15.86 D301.A
N$6
  Bottom 0.152: Q050.3 48.77,1.27 46.59,1.27 R031.1 46.48,2.03 43.94,2.03 D050.A
N$7
  Bottom 0.152: D050.C 43.94,2.77 44.02,2.69 45.21,2.69 R050.1
N$8
  Bottom 0.152: S457.P$2 S457A.1
N$9
  Bottom 0.152: R402.4 15.27,20.62 14.35,21.54 14.22,21.54 D401.2
N$10  (via drill 0.33)
  Top 0.152: v42.32,14.61 42.09,14.38 v42.09,12.19
  Bottom 0.152: v42.32,14.61 42.49,14.61 43.43,15.54 Q201.1 | v42.09,12.19 41.45,11.56 41.45,11.18 S201.2
N$11
  Bottom 0.152: R402.1 15.27,19 14.35,18.09 14.22,18.09 D401.3
N$14
  Top 0.152: C808.1 7.87,22.33 9.93,22.33 10.85,21.41 10.85,18.54 10.26,18.54 U801.8
N$15
  Top 0.152: U801.12 8.13,19.15 7.95,19.33 7.95,20.34 C808.2
N$16
  Top 0.152: U801.10 9.27,19.28 9.27,20.3 C810.1
N$17
  Bottom 0.152: U201.4 43.15,9.54 C203.1
N$20
  Top 0.152: 11.25,6.03 C503.1
  Top 0.406: U501.14 11.25,6.03 | C503.1 C504.1
PWMB  (via drill 0.33)
  Top 0.152: v30.23,18.26 32.69,15.8 32.69,14.25 U401.34
  Bottom 0.152: v30.23,18.26 29.03,19.46 16.33,19.46 16.23,19.56 R402.7
PWMG  (via drill 0.33)
  Top 0.152: v33.2,18.21 33.2,14.25 U401.33
  Bottom 0.152: v33.2,18.21 31.65,19.76 19.2,19.76 18.52,20.45 16.38,20.45 16.23,20.6 R402.5
PWMR  (via drill 0.33)
  Top 0.152: v6.4,13.77 6.68,13.49 v6.68,5.79 | v25.7,4.78 U401.1
  Bottom 0.152: v6.4,13.77 6.38,13.77 6.38,14.68 7.32,15.62 10.41,15.62 11.4,16.61 14.96,16.61 14.96,17.75 16.2,19 R402.8 | v6.68,5.79 7.7,4.78 v25.7,4.78
RAW
  Bottom 0.152: U201.3 45.68,10.16 44.7,10.16 44.7,12.13 U201.1 45.75,12.81 C204.1 45.21,13.46 45.21,16.17 Q201.3
RESET  (via drill 0.33)
  Top 0.152: v23.27,14.68 23.27,15.98 R401.1 | v26.01,10.08 26.01,9.91 25.38,9.27 25.38,8.41 23.88,8.41 U401.57
  Bottom 0.152: v23.27,14.68 24.11,14.68 25.65,13.13 25.65,11.43 S457.P$1 25.78,11.38 26.01,11.38 v26.01,10.08
RTXC1  (via drill 0.33)
  Top 0.152: U401.3 26.67,3.08 v26.67,4.57
  Bottom 0.152: C403.2 Y402.2 26.67,3.05 v26.67,4.57
RTXC2  (via drill 0.33)
  Top 0.152: U401.5 27.69,3.04 v27.69,4.57
  Bottom 0.152: C405.1 Y402.1 27.69,3.27 v27.69,4.57
RX0  (via drill 0.33)
  Top 0.152: v33.78,18.82 33.78,13.51 33.17,12.9 33.17,6.91 35.05,6.91 U401.21
  Bottom 0.152: v33.78,18.82 32.18,20.42 30.38,20.42 J401.3
SCK0
  Top 0.152: J701.5 50.57,15.8 50.14,16.23 50.14,19.48 49.99,19.63 49.99,20.6 48.44,22.15 35.46,22.15 35.46,14.07 34.01,12.62 34.01,10.16 34.27,9.91 35.05,9.91 U401.27
SCK1  (via drill 0.33)
  Top 0.152: 7.9,6.33 7.9,3.91 8.69,3.12 U501.2 | 7.9,6.33 7.9,10.11 U$3.7 | v26.24,12.93 26.24,14.22 U401.47 | v27.76,11.4 27.48,11.12 27.48,7.37 v26.44,6.33 | 7.9,6.33 v8.03,6.33 | J402.1 4.65,11.86 v4.65,7.04
  Bottom 0.152: v27.76,11.4 v26.24,12.93 | v26.44,6.33 v8.03,6.33 7.98,6.38 5.31,6.38 v4.65,7.04
SCL0  (via drill 0.33)
  Top 0.152: v23.88,14.1 23.88,14.55 24.54,15.21 24.54,16.69 R401.2 | U901.4 16.41,14.2 16.41,14.1 v17.3,14.1 17.7,13.69 | v7.54,15.04 7.95,15.44 7.95,16.23 8.13,16.41 U801.1 | v11.18,15.37 11.18,19 11.99,19.81 U101.5 | v36.12,4.12 37.52,5.51 37.52,7.16 37.34,7.34 37.34,7.37 35.08,7.37 U401.22 | v19.1,5.74 17.7,7.14 17.7,13.69 | J401.7 17.75,20.3 17.75,13.74 17.7,13.69
  Bottom 0.152: v17.3,14.1 17.68,14.1 | 17.68,14.1 v23.88,14.1 | v7.54,15.04 7.82,15.32 11.18,15.32 | 11.18,15.32 16.51,15.32 17.68,14.15 17.68,14.1 | v11.18,15.37 11.18,15.32 | v36.12,4.12 28.96,4.12 27.33,5.74 v19.1,5.74
SDA0  (via drill 0.33)
  Top 0.152: v6.96,14.43 6.96,17.02 7.52,17.02 U801.16 | v11.07,14.45 11.99,15.37 11.99,16.03 | 11.99,16.03 11.99,18.29 U101.6 | v15.57,16.03 15.57,15.21 15.49,15.14 U901.6 | v12.04,16.03 11.99,16.03 | 25.04,16.03 25.04,15.29 24.46,14.71 24.46,13.87 24.11,13.51 22.35,13.51 22.35,20.83 J401.6 | 25.04,16.03 25.04,16.71 25.12,16.79 R401.3 | v34.37,15.01 34.37,13.66 33.71,13.01 33.71,9.96 34.04,9.63 34.04,9.4 U401.26 | 25.04,16.03 v25.25,16.03
  Bottom 0.152: v6.96,14.43 6.99,14.45 v11.07,14.45 | v12.04,16.03 v15.57,16.03 15.98,15.62 18.31,15.62 19.46,14.48 22.25,14.48 23.75,15.98 25.2,15.98 v25.25,16.03 26.72,17.5 31.88,17.5 v34.37,15.01
TX0  (via drill 0.33)
  Top 0.152: v31.9,12.93 32.79,12.04 32.79,5.89 U401.19 | v26.98,16.92 26.67,17.22 J401.4
  Bottom 0.152: v31.9,12.93 30.99,13.84 30.99,16.92 v26.98,16.92
USB_LIGHT  (via drill 0.33)
  Top 0.152: v36.93,5.87 36.47,5.41 36.47,4.9 35.08,4.9 U401.17 | v43.66,6.5 44.4,7.24 49.35,7.24 v49.35,2.08
  Bottom 0.152: Q050.1 47.75,3.03 47.75,2.03 49.35,2.03 | 49.35,2.03 51.05,2.03 R051.2 | v36.93,5.87 37.57,6.5 v43.66,6.5 | v49.35,2.08 49.35,2.03
USB_ON  (via drill 0.33)
  Top 0.152: v26.59,9.47 25.68,8.56 25.68,7.9 23.88,7.9 U401.58
  Bottom 0.152: 26.72,9.35 25.76,8.38 S458.P$1 | 26.72,9.35 26.85,9.47 28.75,9.47 29.69,10.41 37.62,10.41 39.98,12.78 44.4,12.78 44.4,16.54 45.01,17.14 46.25,17.14 46.25,14.55 48.11,12.7 R010.1 | 26.72,9.35 v26.59,9.47
USBD+  (via drill 0.33)
  Top 0.152: v35.28,2.95 33.88,2.95 v33.88,2.69 | v30.73,1.73 30.23,2.23 30.23,3.02 U401.10
  Bottom 0.152: R030.1 C030.1 48.06,5.05 47.37,4.37 38.43,4.37 37.01,2.95 v35.28,2.95 | v33.88,2.69 33.5,2.31 31.32,2.31 v30.73,1.73
USBD-  (via drill 0.33)
  Top 0.152: v30.79,4.7 30.73,4.65 30.73,3.05 U401.11
  Bottom 0.152: R020.1 C020.1 48.06,7.59 45.47,5 38.46,5 38.18,5.28 31.37,5.28 v30.79,4.7
VBUS
  Bottom 0.152: J001.1 50.66,8.92 R011.2 C010.1 R010.2 51.82,12.7 51.82,17.53 46.23,17.53 46.23,20.83 44.45,20.83 44.45,20.07 43.5,19.12 D302.1 42.88,18.54 40.89,18.54 C302.1 39.99,19.42 39.56,18.98 U301.4 | R302.2 39.88,18.69 39.57,18.69 U301.4 | J401.1 36.14,19.74 38.79,19.74 39.5,19.02 U301.4
VCC  (via drill 0.33)
  Top 0.152: 9.95,5.97 C502.1 9.86,6.15 9.17,6.83 9.17,7.62 | C408.1 20.07,2.79 18.51,2.79 U402.5 18.29,3.05 17.09,4.24 17.09,8.64 17.04,8.69 | v48.77,3.05 47.75,3.05 v45.21,5.59 45.16,5.64 43.71,5.64 43.08,6.27 43.08,6.73 43.97,7.62 | R401.8 R401.7 R401.6 R401.5 25.68,17.8 v25.68,18.52 | C701.1 49.49,19.97 J701.4 49.45,15.93 49.02,15.49 49.02,12.68 43.97,7.62 | U902.15 40.51,2.56 40.51,3.02 U902.14 40.44,3.07 39.27,3.07 C914.1 39.22,3.61 38.86,3.96 38.86,6.27 | 38.86,6.27 37.16,7.98 36.88,7.98 C423.1 36.7,7.89 U401.23 35,7.85 v33.76,7.85 | 38.86,6.27 40.26,7.67 43.92,7.67 43.97,7.62 | 25.12,5.38 23.88,5.38 U401.63 | 25.12,5.38 25.12,1.7 26.24,0.58 28.65,0.58 28.65,0.96 C407.1 28.71,1.02 U401.7 28.75,3.1 28.75,4.52 v29.87,5.64 | 24.92,12.37 23.88,12.37 U401.49 | 24.92,12.37 24.92,11.66 24.69,11.43 23.93,11.43 U401.51 21.84,11.39 C451.1 21.82,11.23 21.69,11.1 v21.69,10.44 | v27.25,18.59 28.27,17.58 28.27,16.31 C443.1 28.21,16.16 U401.43 28.14,14.22 28.14,12.34 27.18,12.34 | 27.18,12.34 24.97,12.34 24.92,12.37 | 25.12,5.38 25.86,6.12 25.86,7.64 27.18,8.97 27.18,12.34 | U901.8 14.48,15.14 14.07,15.54 14.07,18.97 U101.2 | C101.1 14.99,19.84 U101.2 | U101.3 14.94,21.31 14.99,21.26 14.99,19.91 U101.2 | 9.47,15.85 9.63,15.85 9.63,16.41 U801.4 | 9.47,15.85 8.89,15.85 8.76,15.98 8.76,16.31 8.66,16.41 U801.2 | 9.5,13.54 9.5,14.2 9.53,14.22 C602.1 9.47,14.28 9.47,15.85 | 9.5,13.54 9.5,12.85 9.4,12.75 U$3.2 | U801.13 7.52,18.54 6.35,18.54 C802.1 6.3,18.69 v5.38,18.69 | 9.5,13.54 v10.36,13.54 11.46,12.45 v11.46,11.46 | v13.79,20.3 13.79,20.27 14.53,19.53 U101.2 | U901.15 14.5,12.32 U901.14 14.48,12.24 14.2,11.96 14.2,11.46
  Top 0.152: 17.04,8.69 17.4,9.04 17.4,12.7 16.41,12.7 U901.1 | 15.77,8.69 14.15,8.69 C901.1 14.2,10.46 14.2,11.46 | 15.77,8.69 17.04,8.69 | 9.17,7.62 9.17,8.36 9.3,8.48 9.3,10.03 9.37,10.11 U$3.10 | v8.48,7.62 9.17,7.62 | v15.77,7.8 15.77,8.69 | 14.2,11.46 v14.07,11.46
  Top 0.406: U501.16 9.95,5.97 | U501.16 U501.15 | U501.16 9.07,4.64 U501.1
  Bottom 0.152: R051.1 49.72,2.68 Q050.2 48.78,3.03 v48.77,3.05 | U201.5 44.13,12.13 44.2,12.19 44.2,9.91 44.45,9.65 44.45,7.62 C201.1 45.21,7.51 v45.21,5.59 | v25.68,18.52 25.76,18.59 v27.25,18.59 | v10.36,13.54 10.01,13.18 6.17,13.18 5.44,13.92 5.44,18.64 v5.38,18.69 7.19,20.5 11.66,20.5 12.7,21.54 D401.1 12.68,21.41 v13.79,20.3 | J402.4 v8.48,7.62 8.91,7.19 15.16,7.19 v15.77,7.8 | v11.46,11.46 v14.07,11.46 14.12,11.4 16.36,11.4 17.02,10.74 21.39,10.74 v21.69,10.44 | v33.76,7.85 32.36,6.45 30.68,6.45 v29.87,5.64
VIN
  Bottom 0.152: D302.3 45.55,17.46 Q201.2 41.43,15.44 S201.3
VLIPO
  Bottom 0.152: J301.2 48.88,21.34 43.45,21.34 D302.2 43.45,20.72 C301.1 42.16,20.07 39.56,20.07 U301.3
XACC  (via drill 0.33)
  Top 0.152: U902.5 43.84,2.04 | 43.84,2.04 44.32,2.04 arc90 C905.1 | 43.84,2.04 43.84,3.79 v40.54,7.09 | v31.9,9.83 30.73,11 30.73,14.22 U401.38
  Bottom 0.152: v40.54,7.09 39.14,8.48 37.39,8.48 36.04,9.83 v31.9,9.83
XTAL1
  Top 0.152: C462.2 Y401.3 21.73,5.89 U401.62
XTAL2
  Top 0.152: U401.61 23.62,6.39 23.62,6.35 21.08,6.35 20.43,7 Y401.1 C461.2
YACC  (via drill 0.33)
  Top 0.152: C904.1 44.55,1.37 42.67,1.37 U902.4 42.67,1.29 42.52,1.14 42.52,0.99 42.34,0.81 v40.11,0.81 | v31.9,1.73 31.73,1.91 31.73,3.02 U401.13
  Bottom 0.152: v40.11,0.81 39.19,1.73 v31.9,1.73
ZACC  (via drill 0.33)
  Top 0.152: 40.06,1.6 39.47,1.02 C916.1 | 40.06,1.6 40.49,2.03 U902.16 | 40.06,1.6 38.56,3.1 38.56,4.09 v37.95,4.7 | v31.62,4.7 30.23,6.1 30.23,14.22 U401.39
  Bottom 0.152: v31.62,4.7 v37.95,4.7

### Text on the board
tPlace: SCL | SDA | BSL | TX0 | RX0 | GND | VBUS | Compass | Baro | stkwans.blogspot.com | SCK | Acc | MISO | MOSI | Acc | 3V3 | Acc | Y | Z | Gyro | X
bPlace: SCL | SDA | BSL | TX0 | RX0 | GND | VBUS | + | - | Kwan Systems | the Terminally ADD | a division of | St Kwan's Home for | Y | On | Z | v1.0 25 Dec 2012 | Rocketometer2148 | X
bDocu: S | D | G